# EAGLE design ArduStationMega0.4 (EAGLE 5.11)
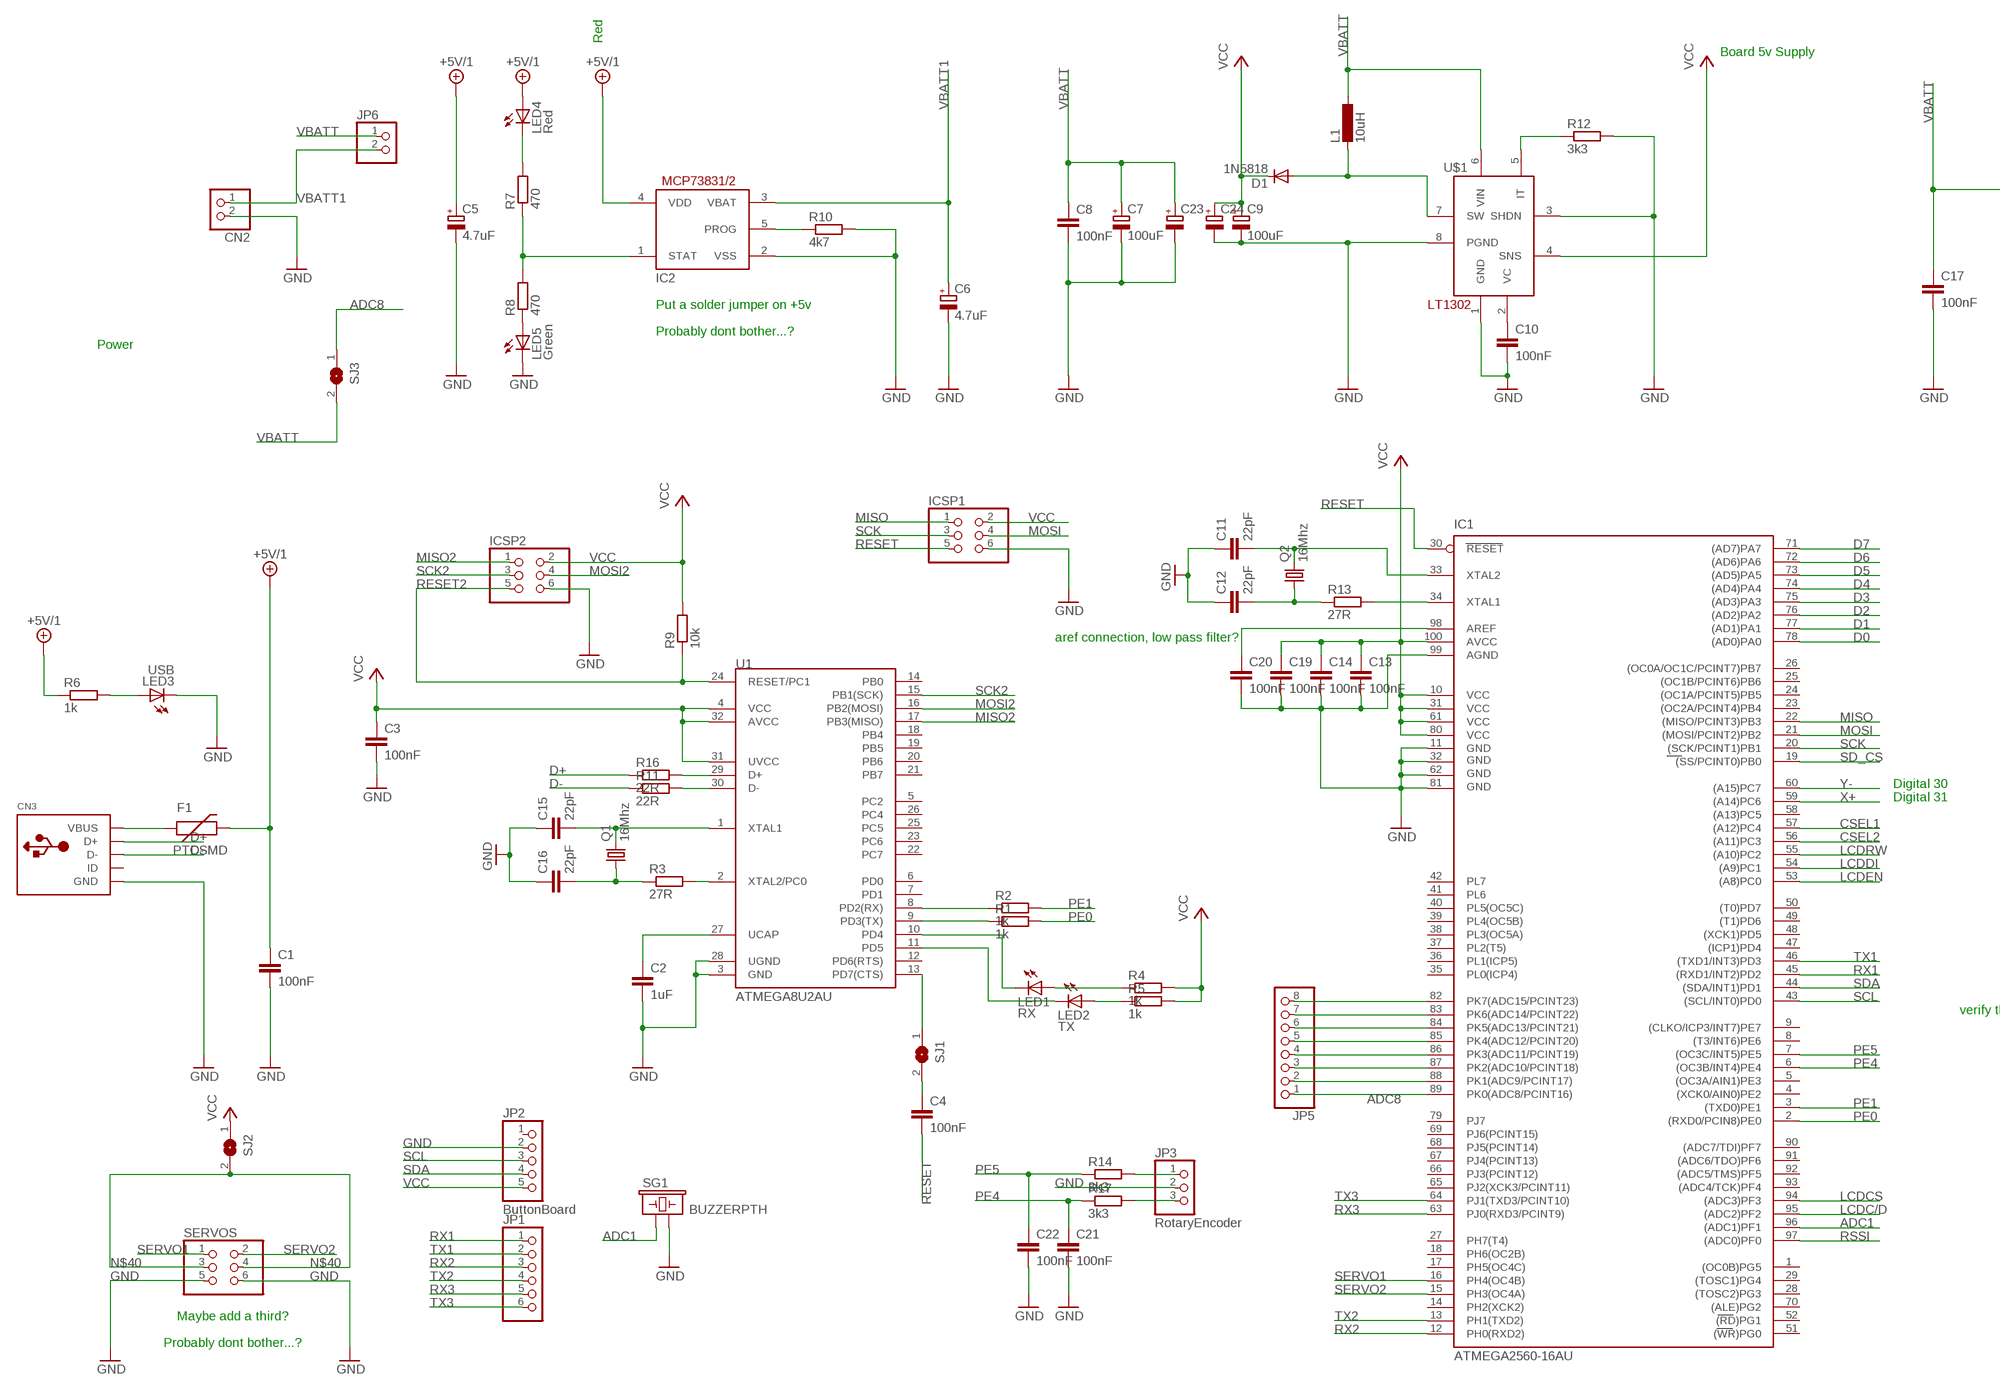
[diagram p0: schematic, sheet 1, part 1 of 2]
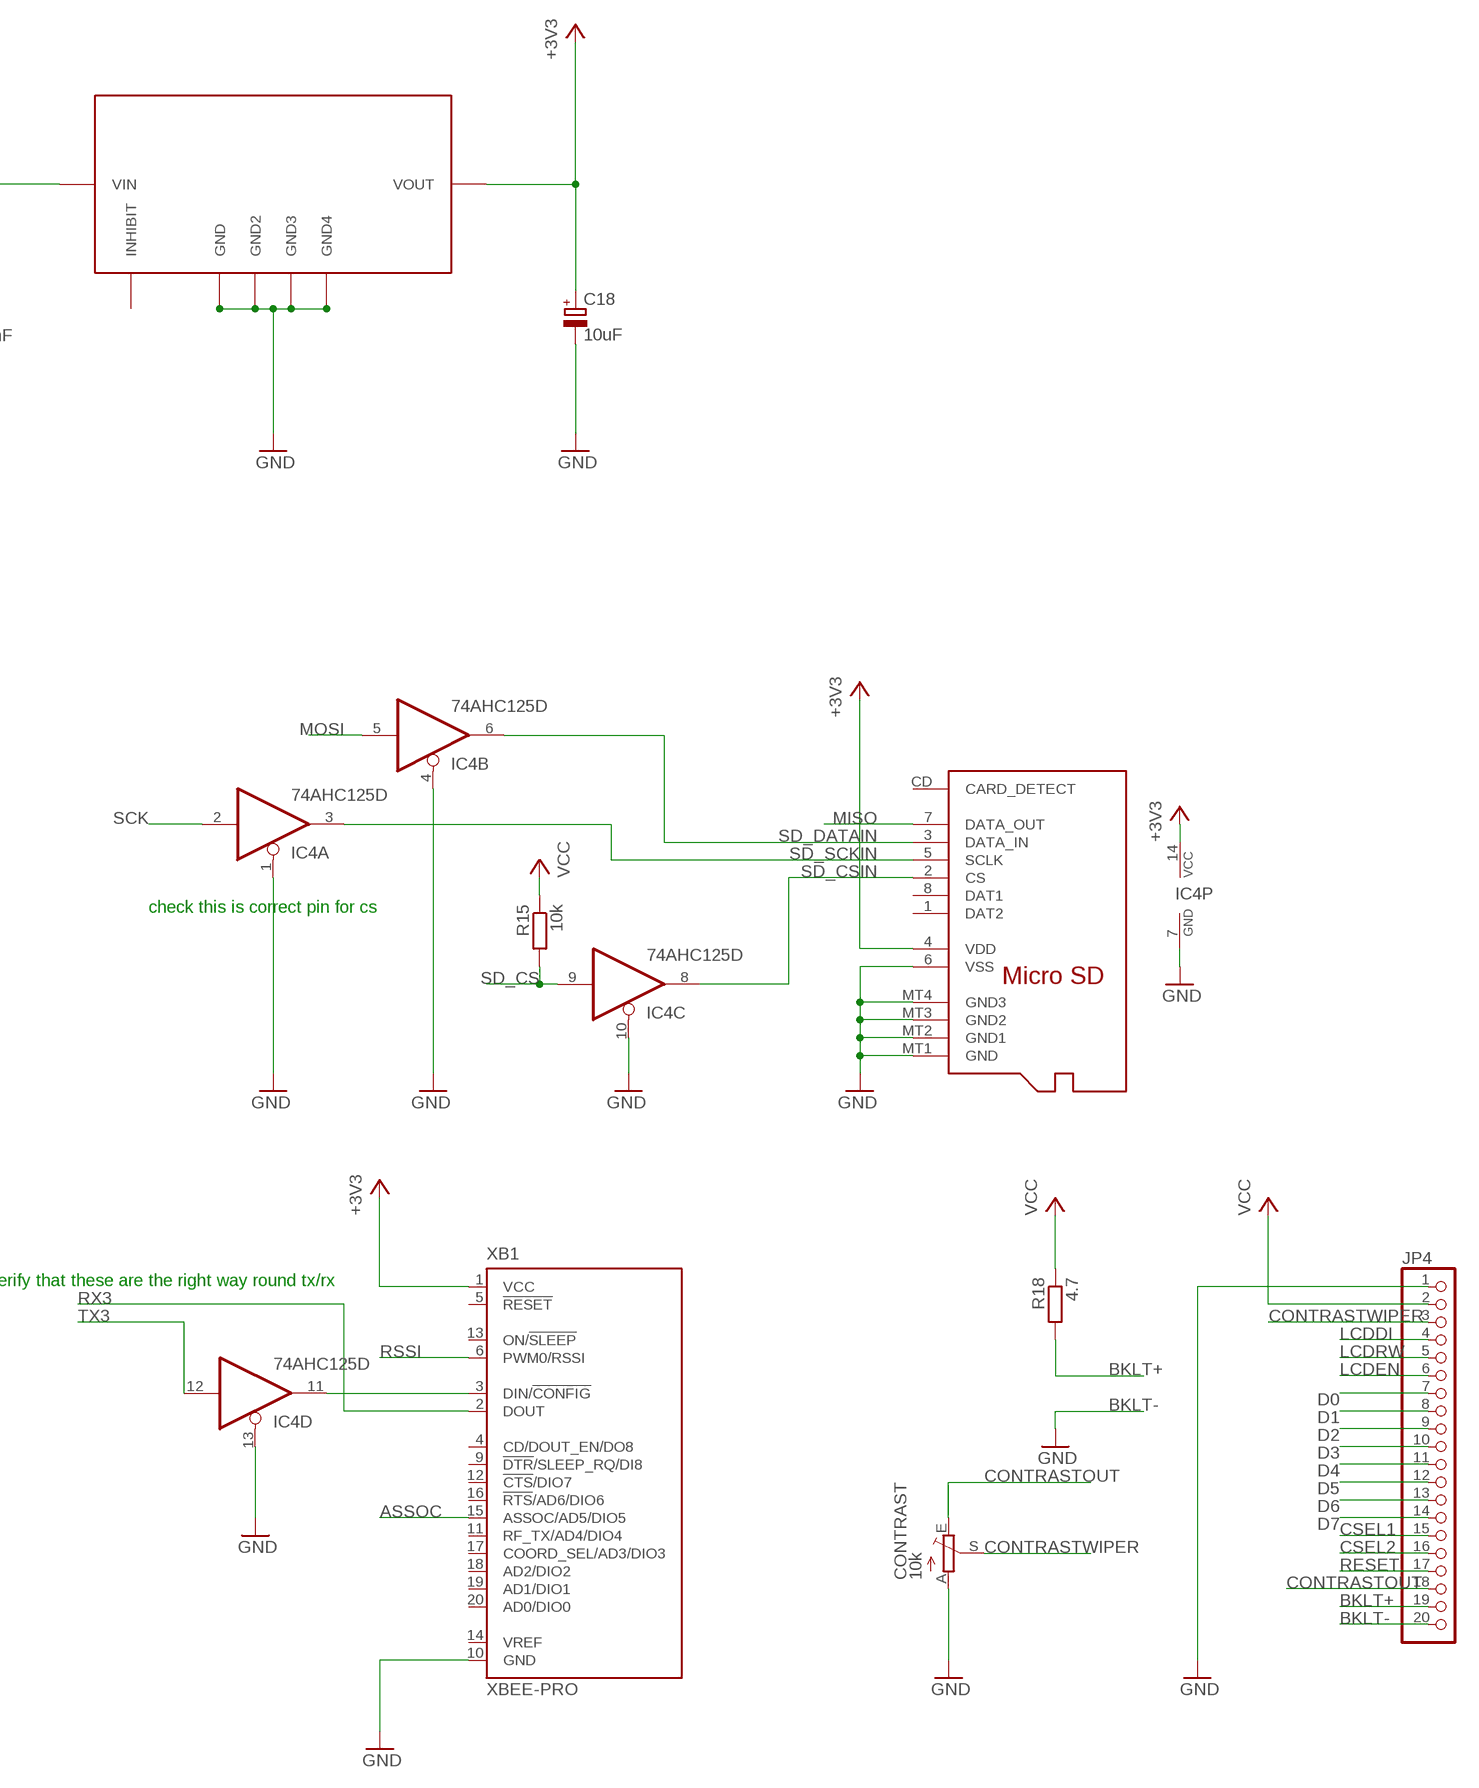
[diagram p1: schematic, sheet 1, part 2 of 2]

## Parts
C1  100nF  C-EUC0805  [C0805]
C2  1uF  C-EUC0805  [C0805]
C3  100nF  C-EUC0805  [C0805]
C4  100nF  C-EUC0805  [C0805]
C5  4.7uF  CPOL-EUA/3216-18R  [A/3216-18R]
C6  4.7uF  CPOL-EUA/3216-18R  [A/3216-18R]
C7  100uF  CPOL-EUD  [PANASONIC_D]
C8  100nF  C-EUC0805  [C0805]
C9  100uF  CPOL-EUD  [PANASONIC_D]
C10  100nF  C-EUC0805  [C0805]
C11  22pF  C-EUC0805  [C0805]
C12  22pF  C-EUC0805  [C0805]
C13  100nF  C-EUC0805  [C0805]
C14  100nF  C-EUC0805  [C0805]
C15  22pF  C-EUC0805  [C0805]
C16  22pF  C-EUC0805  [C0805]
C17  100nF  C-EUC0805  [C0805]
C18  10uF  CPOL-EUA/3216-18R  [A/3216-18R]
C19  100nF  C-EUC0805  [C0805]
C20  100nF  C-EUC0805  [C0805]
C21  100nF  C-EUC0805  [C0805]
C22  100nF  C-EUC0805  [C0805]
C23  CPOL-EUE2.5-7  [E2,5-7]
C24  CPOL-EUE2.5-7  [E2,5-7]
CN2  JST_2PIN-SMT-RA  [JST-PH-2-SMT-RA]
CN3  USB  [USB-MINIB-SMD-MOLEX]
CONTRAST  10k  TRIM_EU-B25P  [B25P]
D1  1N5818  DIODE-DO41-7.6  [DO41-7.6]
F1  PTCSMD  [PTC-1206]
IC1  ATMEGA2560-16AU  [TQFP100]
IC2  MCP73831/OT  [SOT23-5L]
IC4  74AHC125D  74ACT125D  [SO14]
ICSP1  PINHD-2X3  [2X03]
ICSP2  PINHD-2X3  [2X03]
JP1  PINHD-1X6  [1X06]
JP2  ButtonBoard  PINHD-1X5  [1X05]
JP3  RotaryEncoder  PINHD-1X3  [1X03]
JP4  PINHD-1X20  [1X20]
JP5  PINHD-1X8  [1X08]
JP6  PINHD-1X2/90  [1X02/90]
L1  10uH  L-EU6000-XXX-RC  [6000-XXXX-RC]
LED1  RX  LEDSMT1206  [1206]
LED2  TX  LEDSMT1206  [1206]
LED3  USB  LEDSMT1206  [1206]
LED4  Red  LEDSMT1206  [1206]
LED5  Green  LEDSMT1206  [1206]
Q1  16Mhz  CRYSTAL5X3  [CRYSTAL-SMD-5X3]
Q2  16Mhz  CRYSTAL5X3  [CRYSTAL-SMD-5X3]
R1  1k  R-EU_R0805  [R0805]
R2  1k  R-EU_R0805  [R0805]
R3  27R  R-EU_R0805  [R0805]
R4  1k  R-EU_R0805  [R0805]
R5  1k  R-EU_R0805  [R0805]
R6  1k  R-EU_R0805  [R0805]
R7  470  R-EU_R0805  [R0805]
R8  470  R-EU_R0805  [R0805]
R9  10k  R-EU_R0805  [R0805]
R10  4k7  R-EU_R0805  [R0805]
R11  22R  R-EU_R0805  [R0805]
R12  3k3  R-EU_R0805  [R0805]
R13  27R  R-EU_R0805  [R0805]
R14  3k3  R-EU_R0805  [R0805]
R15  10k  R-EU_R0805  [R0805]
R16  22R  R-EU_R0805  [R0805]
R17  3k3  R-EU_R0805  [R0805]
R18  4.7  R-EU_R0805  [R0805]
SERVOS  PINHD-2X3/90  [2X03/90]
SG1  BUZZERPTH  [BUZZER-12MM]
SJ1  SJ  [SJ]
SJ2  SJ  [SJ]
SJ3  SJ  [SJ]
U1  ATMEGA8U2AU  [TQFP32-08]
U$1  LT1302  [DIL08]
U$2  KF33BD-TR  [SO-8]
U$4  MICROSD  [MICROSD]
XB1  XBEE-PRO  [XBEE-PRO]

## Nets
+3V3: C18.+ IC4.14(P:VCC) U$2.1(VOUT) U$4.4(VDD) XB1.1(VCC)
+5V/1: C1.1 C5.+ F1.2 IC2.4(VDD) LED4.A R6.1
ADC1: IC1.96((ADC1)PF1) SG1.+
ADC8: IC1.89(PK0(ADC8/PCINT16)) JP5.1 SJ3.1
ADC15: IC1.82(PK7(ADC15/PCINT23)) JP5.8
ASSOC: XB1.15(ASSOC/AD5/DIO5)
BKLT+: JP4.19 R18.2
BKLT-: JP4.20 ; supply symbol labelled GND
CONTRASTOUT: CONTRAST.E JP4.18
CONTRASTWIPER: CONTRAST.S JP4.3
CSEL1: IC1.57((A12)PC4) JP4.15
CSEL2: IC1.56((A11)PC3) JP4.16
D0: IC1.78((AD0)PA0) JP4.7
D1: IC1.77((AD1)PA1) JP4.8
D2: IC1.76((AD2)PA2) JP4.9
D3: IC1.75((AD3)PA3) JP4.10
D4: IC1.74((AD4)PA4) JP4.11
D5: IC1.73((AD5)PA5) JP4.12
D6: IC1.72((AD6)PA6) JP4.13
D7: IC1.71((AD7)PA7) JP4.14
D+: CN3.D+ R16.1
D-: CN3.D- R11.1
GND: C1.2 C2.2 C3.2 C5.- C6.- C7.- C8.2 C9.- C10.2 C11.1 C12.1 C13.2 C14.2 C15.1 C16.1 C17.2 C18.- C19.2 C20.2 C21.2 C22.2 C23.- C24.- CN2.2 CN3.GND CONTRAST.A IC1.11(GND) IC1.32(GND1) IC1.62(GND2) IC1.81(GND3) IC1.99(AGND) IC2.2(VSS) IC4.1(A:OE) IC4.4(B:OE) IC4.7(P:GND) IC4.10(C:OE) IC4.13(D:OE) ICSP1.6 ICSP2.6 JP2.2 JP3.2 JP4.1 LED3.C LED5.C R10.2 R12.2 SERVOS.5 SERVOS.6 SG1.- U1.3(GND) U1.28(UGND) U$1.1(GND) U$1.3(SHDN) U$1.8(PGND) U$2.2(GND) U$2.3(GND2) U$2.6(GND3) U$2.7(GND4) U$4.6(VSS) U$4.MT1(GND) U$4.MT2(GND1) U$4.MT3(GND2) U$4.MT4(GND3) XB1.10(GND)
LCDC/D: IC1.95((ADC2)PF2)
LCDCS: IC1.94((ADC3)PF3)
LCDDI: IC1.54((A9)PC1) JP4.4
LCDEN: IC1.53((A8)PC0) JP4.6
LCDRW: IC1.55((A10)PC2) JP4.5
MISO: IC1.22((MISO/PCINT3)PB3) ICSP1.1 U$4.7(DATA_OUT)
MISO2: ICSP2.1 U1.17(PB3(MISO))
MOSI: IC1.21((MOSI/PCINT2)PB2) IC4.5(B:I) ICSP1.4
MOSI2: ICSP2.4 U1.16(PB2(MOSI))
N$1: IC4.11(D:O) XB1.3(DIN/!CONFIG)
N$2: LED3.A R6.2
N$3: C2.1 U1.27(UCAP)
N$4: R3.2 U1.2(XTAL2/PC0)
N$5: C16.2 Q1.1 R3.1
N$6: C15.2 Q1.3 U1.1(XTAL1)
N$7: LED1.C U1.10(PD4)
N$8: R2.1 U1.8(PD2(RX))
N$9: C4.1 SJ1.2
N$10: R1.1 U1.9(PD3(TX))
N$11: LED2.C U1.11(PD5)
N$12: LED1.A R4.1
N$13: LED2.A R5.1
N$14: R12.1 U$1.5(IT)
N$15: LED4.C R7.2
N$16: IC2.1(STAT) R7.1 R8.2
N$17: SJ1.1 U1.13(PD7(CTS))
N$18: R16.2 U1.29(D+)
N$19: R11.2 U1.30(D-)
N$20: JP3.3 R17.2
N$21: IC2.5(PROG) R10.1
N$22: JP3.1 R14.2
N$23: C10.1 U$1.2(VC)
N$24: CN3.VBUS F1.1
N$25: D1.A L1.2 U$1.7(SW)
N$26: LED5.A R8.1
N$27: IC1.34(XTAL1) R13.2
N$28: C12.2 Q2.1 R13.1
N$29: C11.2 IC1.33(XTAL2) Q2.3
N$31: C20.1 IC1.98(AREF)
N$32: IC1.88(PK1(ADC9/PCINT17)) JP5.2
N$33: IC1.87(PK2(ADC10/PCINT18)) JP5.3
N$34: IC1.86(PK3(ADC11/PCINT19)) JP5.4
N$35: IC1.85(PK4(ADC12/PCINT20)) JP5.5
N$36: IC1.84(PK5(ADC13/PCINT21)) JP5.6
N$37: IC1.83(PK6(ADC14/PCINT22)) JP5.7
N$40: SERVOS.3 SERVOS.4 SJ2.2
PE0: IC1.2((RXD0/PCIN8)PE0) R1.2
PE1: IC1.3((TXD0)PE1) R2.2
PE4: C21.1 IC1.6((OC3B/INT4)PE4) R17.1
PE5: C22.1 IC1.7((OC3C/INT5)PE5) R14.1
RESET: C4.2 IC1.30(RESET) ICSP1.5 JP4.17
RESET2: ICSP2.5 R9.1 U1.24(RESET/PC1)
RSSI: IC1.97((ADC0)PF0) XB1.6(PWM0/RSSI)
RX1: IC1.45((RXD1/INT2)PD2) JP1.1
RX2: IC1.12(PH0(RXD2)) JP1.3
RX3: IC1.63(PJ0(RXD3/PCINT9)) JP1.5 XB1.2(DOUT)
SCK: IC1.20((SCK/PCINT1)PB1) IC4.2(A:I) ICSP1.3
SCK2: ICSP2.3 U1.15(PB1(SCK))
SCL: IC1.43((SCL/INT0)PD0) JP2.3
SD_CS: IC1.19((SS/PCINT0)PB0) IC4.9(C:I) R15.2
SD_CSIN: IC4.8(C:O) U$4.2(CS)
SD_DATAIN: IC4.6(B:O) U$4.3(DATA_IN)
SD_SCKIN: IC4.3(A:O) U$4.5(SCLK)
SDA: IC1.44((SDA/INT1)PD1) JP2.4
SERVO1: IC1.16(PH4(OC4B)) SERVOS.1
SERVO2: IC1.15(PH3(OC4A)) SERVOS.2
TX1: IC1.46((TXD1/INT3)PD3) JP1.2
TX2: IC1.13(PH1(TXD2)) JP1.4
TX3: IC1.64(PJ1(TXD3/PCINT10)) IC4.12(D:I) JP1.6
VBATT: C7.+ C8.1 C17.1 C23.+ JP6.1 L1.1 SJ3.2 U$1.6(VIN) U$2.8(VIN)
VBATT1: C6.+ CN2.1 IC2.3(VBAT) JP6.2
VCC: C3.1 C9.+ C13.1 C14.1 C19.1 C24.+ D1.C IC1.10(VCC) IC1.31(VCC1) IC1.61(VCC2) IC1.80(VCC3) IC1.100(AVCC) ICSP1.2 ICSP2.2 JP2.5 JP4.2 R4.2 R5.2 R9.2 R15.1 R18.1 SJ2.1 U1.4(VCC) U1.31(UVCC) U1.32(AVCC) U$1.4(SNS)
X+: IC1.59((A14)PC6)
Y-: IC1.60((A15)PC7)
Unconnected: CN3.ID IC1.1((OC0B)PG5) IC1.4((XCK0/AIN0)PE2) IC1.5((OC3A/AIN1)PE3) IC1.8((T3/INT6)PE6) IC1.9((CLKO/ICP3/INT7)PE7) IC1.14(PH2(XCK2)) IC1.17(PH5(OC4C)) IC1.18(PH6(OC2B)) IC1.23((OC2A/PCINT4)PB4) IC1.24((OC1A/PCINT5)PB5) IC1.25((OC1B/PCINT6)PB6) IC1.26((OC0A/OC1C/PCINT7)PB7) IC1.27(PH7(T4)) IC1.28((TOSC2)PG3) IC1.29((TOSC1)PG4) IC1.35(PL0(ICP4)) IC1.36(PL1(ICP5)) IC1.37(PL2(T5)) IC1.38(PL3(OC5A)) IC1.39(PL4(OC5B)) IC1.40(PL5(OC5C)) IC1.41(PL6) IC1.42(PL7) IC1.47((ICP1)PD4) IC1.48((XCK1)PD5) IC1.49((T1)PD6) IC1.50((T0)PD7) IC1.51((WR)PG0) IC1.52((RD)PG1) IC1.58((A13)PC5) IC1.65(PJ2(XCK3/PCINT11)) IC1.66(PJ3(PCINT12)) IC1.67(PJ4(PCINT13)) IC1.68(PJ5(PCINT14)) IC1.69(PJ6(PCINT15)) IC1.70((ALE)PG2) IC1.79(PJ7) IC1.90((ADC7/TDI)PF7) IC1.91((ADC6/TDO)PF6) IC1.92((ADC5/TMS)PF5) IC1.93((ADC4/TCK)PF4) JP2.1 U1.5(PC2) U1.6(PD0) U1.7(PD1) U1.12(PD6(RTS)) U1.14(PB0) U1.18(PB4) U1.19(PB5) U1.20(PB6) U1.21(PB7) U1.22(PC7) U1.23(PC6) U1.25(PC5) U1.26(PC4) U$2.5(INHIBIT) U$4.1(DAT2) U$4.8(DAT1) U$4.CD(CARD_DETECT) XB1.4(CD/DOUT_EN/DO8) XB1.5(!RESET) XB1.9(!DTR!/SLEEP_RQ/DI8) XB1.11(RF_TX/AD4/DIO4) XB1.12(!CTS!/DIO7) XB1.13(ON/!SLEEP) XB1.14(VREF) XB1.16(!RTS!/AD6/DIO6) XB1.17(COORD_SEL/AD3/DIO3) XB1.18(AD2/DIO2) XB1.19(AD1/DIO1) XB1.20(AD0/DIO0)

## Notes on the sheet
- Red
- Board 5v Supply
- Put a solder jumper on +5v
- Probably dont bother...?
- Power
- aref connection, low pass filter?
- check this is correct pin for cs
- Digital 30
- Digital 31
- verify that these are the right way round tx/rx
- Maybe add a third?
- Probably dont bother...?

## Library data of the parts
C1-C4 C8 C10-C17 C19-C22 = rcl:C-EU: CAPACITOR, European symbol
C5-C7 C9 C18 C23 C24 = rcl:CPOL-EU: POLARIZED CAPACITOR, European symbol
CN2 = adafruit:JST_2PIN: JST 2-Pin Connectors of various flavors SMT-RA (S2B-PH-SM4) 4UConnector #17311 SMT (B2B-PH-SM4) THM-RA (S2B-PH) THM (B2B-PH)
CN3 = colin:USB: USB Connectors USBMINIB - Surface Mount Female Mini-B USB Connector 4UConnector: 06564 By microbuilder.eu Thru-hole RA Female Mini-B USB Connector 4UConnector: 18732 By ladyada.net
CONTRAST = pot:TRIM_EU-: POTENTIOMETER
D1 = diode:DIODE-: DIODE
F1 = SparkFun:PTC: Resettable Fuse PTC Resettable Fuse. Spark Fun Electronics SKU : COM-08357
IC1 = atmel-2005:ATMEGA*: MICROCONTROLLER 64/128/256 Kbytes FLASH 4 Kbytes EEPROM 8 Kbytes SRAM 86 General Purpose I/O pins 12-channels16-bit PWM 4 x Serial USARTs 16-channels 10-bit A/D
IC2 = adafruit:MCP73831: MCP73831/2 Miniature Single-Cell, Fully Integrated Li-Ion, Li-Polymer Charge Management Controllers. Nice and small simple lipoly charge controller, with adjustable current and status output (LED) http://www.ladyada.net/library/pcb/eaglelibrary.html
IC4 = 74xx-eu:74*125: Quad bus BUFFER, 3-state
ICSP1 ICSP2 SERVOS = pinhead:PINHD-2X3: PIN HEADER
JP1 = pinhead:PINHD-1X6: PIN HEADER
JP2 = pinhead:PINHD-1X5: PIN HEADER
JP3 = pinhead:PINHD-1X3: PIN HEADER
JP4 = pinhead:PINHD-1X20: PIN HEADER
JP5 = pinhead:PINHD-1X8: PIN HEADER
JP6 = pinhead:PINHD-1X2: PIN HEADER
L1 = rcl:L-EU: INDUCTOR, European symbol
LED1-LED5 = led:LED: LED OSRAM: - CHIPLED LG R971, LG N971, LY N971, LG Q971, LY Q971, LO R971, LY R971 LH N974, LH R974 LS Q976, LO Q976, LY Q976 LO Q996 - Hyper CHIPLED LW Q18S LB Q993, LB Q99A, LB R99A - SideLED LS A670, LO A670, LY A670, LG A670, LP A670 LB A673, LV A673, LT A673, LW A673 LH A674 LY A675 LS A676, LA A676, LO A676, LY A676, LW A676 LS A679, LY A679, LG A679 - Hyper Micro SIDELED® LS Y876, LA Y876, LO Y876, LY Y876 LT Y87S - SmartLED LW L88C, LW L88S LB L89C, LB L89S, LG L890 LS L89K, LO L89K, LY L89K LS L896, LA L896, LO L896, LY L896 - TOPLED LS T670, LO T670, LY T670, LG T670, LP T670 LSG T670, LSP T670, LSY T670, LOP T670, LYG T670 LG T671, LOG T671, LSG T671 LB T673, LV T673, LT T673, LW T673 LH T674 LS T676, LA T676, LO T676, LY T676, LB T676, LH T676, LSB T676, LW T676 LB T67C, LV T67C, LT T67C, LS T67K, LO T67K, LY T67K, LW E67C LS E67B, LA E67B, LO E67B, LY E67B, LB E67C, LV E67C, LT E67C LW T67C LS T679, LY T679, LG T679 LS T770, LO T770, LY T770, LG T770, LP T770 LB T773, LV T773, LT T773, LW T773 LH T774 LS E675, LA E675, LY E675, LS T675 LS T776, LA T776, LO T776, LY T776, LB T776 LHGB T686 LT T68C, LB T68C - Hyper Mini TOPLED® LB M676 - Mini TOPLED Santana® LG M470 LS M47K, LO M47K, LY M47K Source: http://www.osram.convergy.de LUXEON: - LUMILED® LXK2-PW12-R00, LXK2-PW12-S00, LXK2-PW14-U00, LXK2-PW14-V00 LXK2-PM12-R00, LXK2-PM12-S00, LXK2-PM14-U00 LXK2-PE12-Q00, LXK2-PE12-R00, LXK2-PE12-S00, LXK2-PE14-T00, LXK2-PE14-U00 LXK2-PB12-K00, LXK2-PB12-L00, LXK2-PB12-M00, LXK2-PB14-N00, LXK2-PB14-P00, LXK2-PB14-Q00 LXK2-PR12-L00, LXK2-PR12-M00, LXK2-PR14-Q00, LXK2-PR14-R00 LXK2-PD12-Q00, LXK2-PD12-R00, LXK2-PD12-S00 LXK2-PH12-R00, LXK2-PH12-S00 LXK2-PL12-P00, LXK2-PL12-Q00, LXK2-PL12-R00 Source: www.luxeon.com KINGBRIGHT: KA-3528ASYC Source: www.kingbright.com
Q1 Q2 = SparkFun:CRYSTAL: Crystals Various standard crystals. Proven footprints. Spark Fun Electronics SKU : COM-00534
R1-R18 = rcl:R-EU_: RESISTOR, European symbol
SG1 = SparkFun:BUZZER: Buzzer 12mm Spark Fun Electronics SKU : Comp-Buzzer
SJ1-SJ3 = jumper:SJ: SMD solder JUMPER
U1 = SparkFun:ATMEGA8U2: Atmel 8-bit Microcontroller with 8/16/32K Bystes of ISP Flash and USB Controller. ATmega8U2, ATmega16U2, and ATmega32U2
U$1 = adafruit:LT1302
U$2 = colin:KF33BD-TR
U$4 = colin:MICROSD
XB1 = maxstream:XBEE: XBee (TM) /XBee-PRO(TM) OEM RF Modules Source: MaxStream, Inc. xbee_productmanual.pdf; MPN: XBP24-AWI-001; OC_FARNELL: 1337916; OC_NEWARK: 42M2667

## Net classes
1 power: width 0.61 mm

## Board
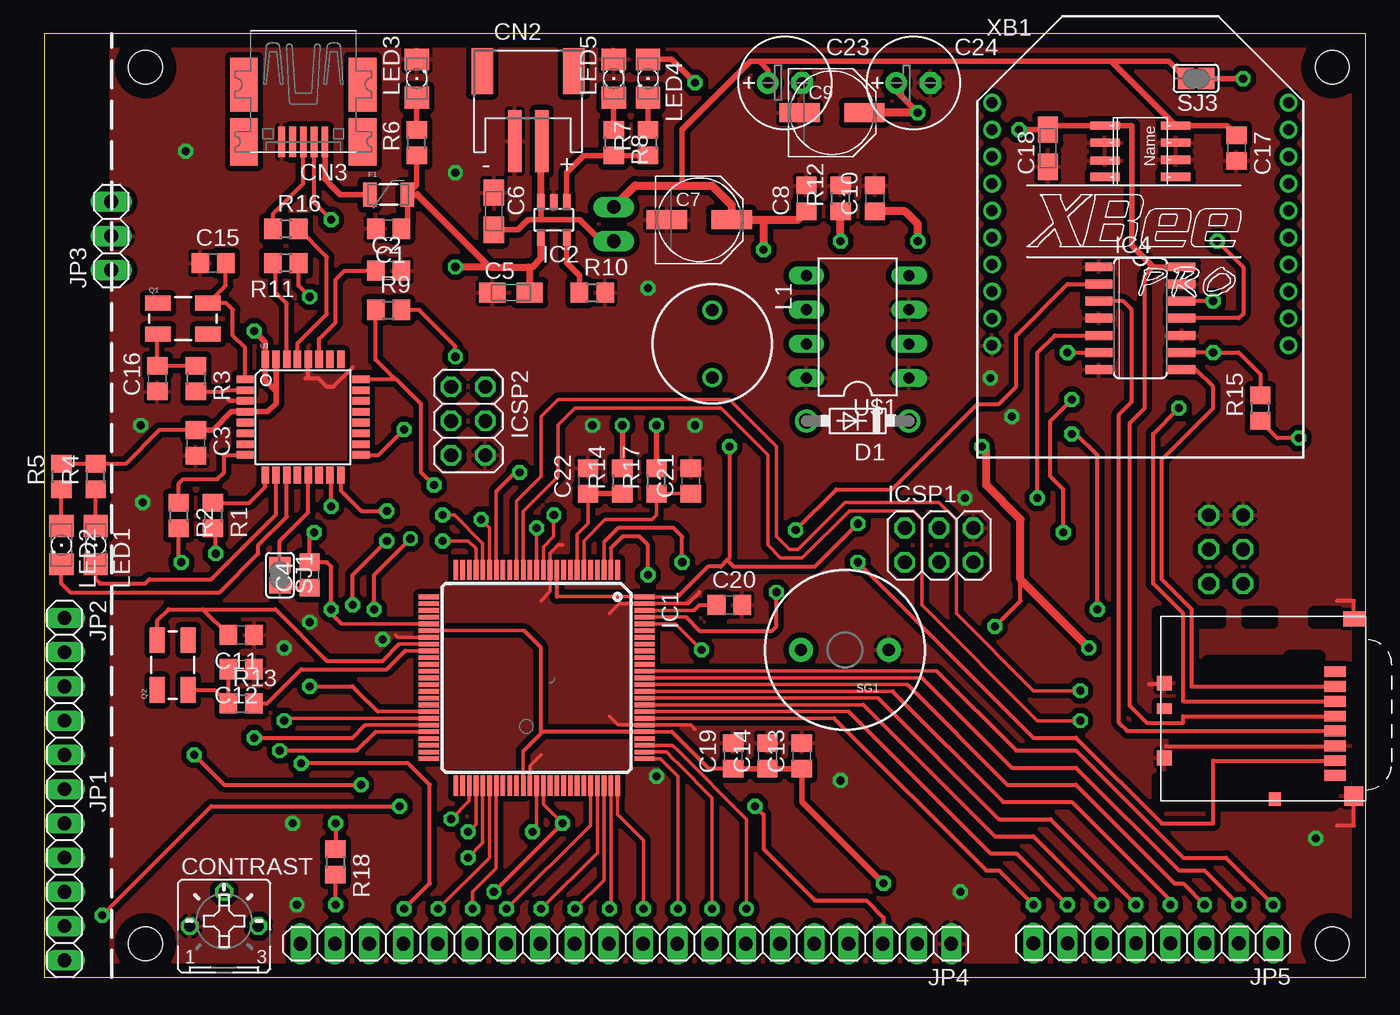
[diagram p2: board, top side]
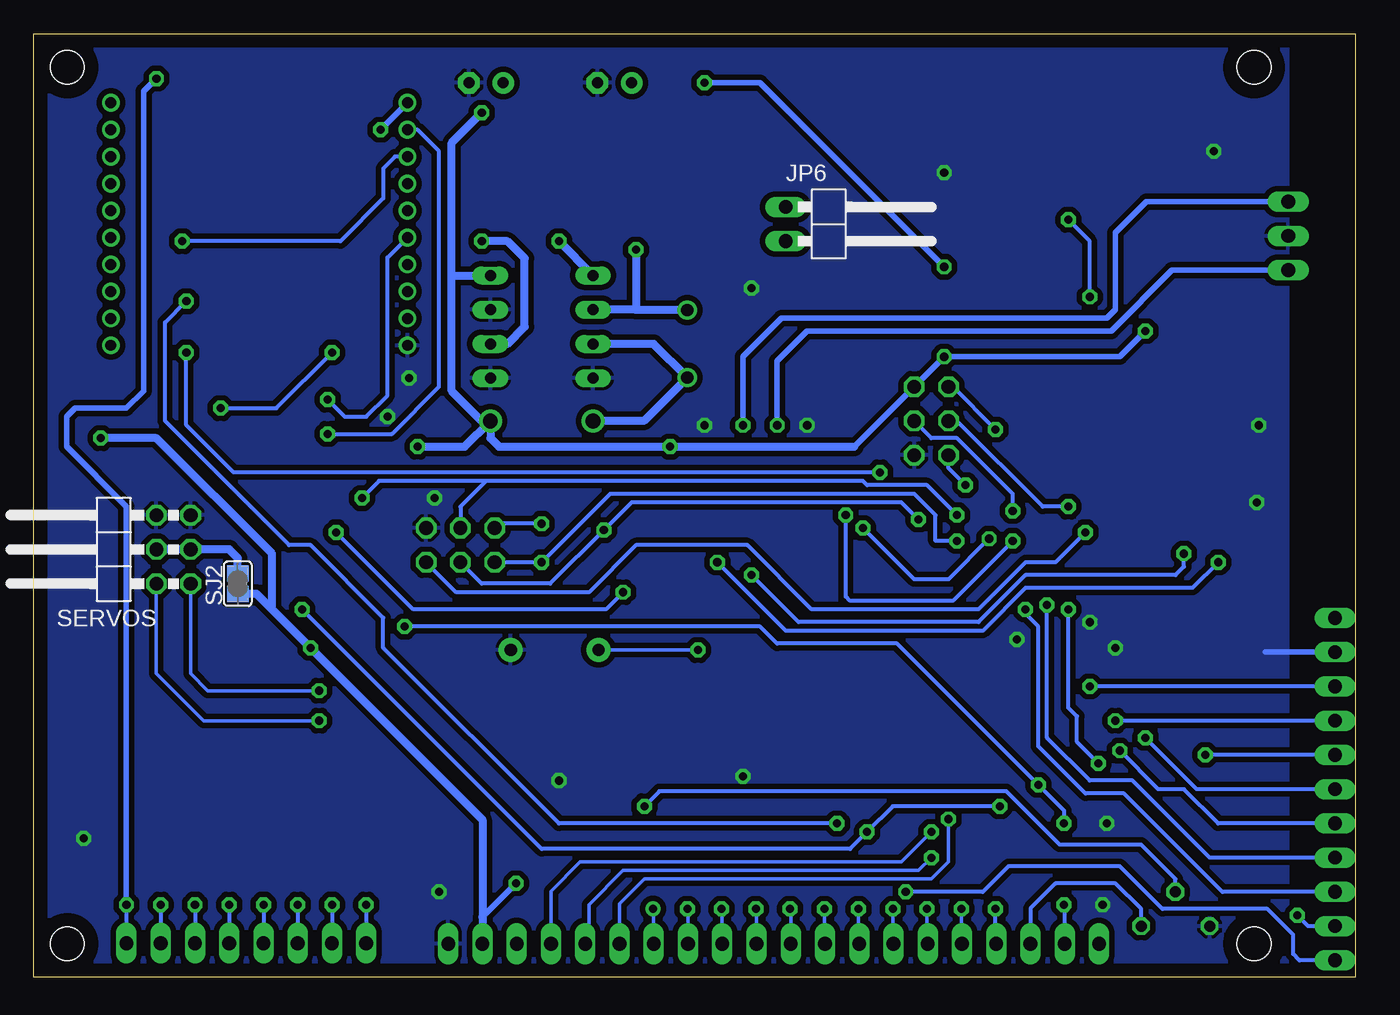
[diagram p3: board, bottom side, seen from below]

Size 98 x 70 mm. Coordinates in mm from the lower left corner, seen from the top.
Outline: 0,0 98,0 98,70 0,70 0,0
Copper layers (1*16): Top 0.035mm / dielectric 1.5mm / Bottom 0.035mm
Design rules "default *": minimum track width 10mil, minimum drill 0.6mm, track to track 8mil, track to pad 8mil, pad to pad 8mil, via to via 8mil, smd to smd 8mil, copper to edge 40mil, drill to drill 8mil, minimum pad ring 10mil, minimum via ring 10mil, stop-mask expansion 4mil, vias tented up to drill 0mil, thermal gap 10mil
Holes 2.5 mm at 7.5,2.5 7.5,67.5 95.5,67.5 95.5,2.5

### Footprints (pad centres in the part's own frame; a part is rotated, then mirrored left to right if it is on the bottom)
C0805 = smd 1.3 x 1.5: 1 -0.95,0; 2 0.95,0
A/3216-18R = smd 1.95 x 1.5: + 1.375,0; - -1.375,0
PANASONIC_D = smd 3 x 1.4: + 2.4,0; - -2.4,0
E2,5-7 = drill 0.813 pad 1.6 round: + -1.27,0 | drill 0.813 pad 1.6 octagon: - 1.27,0
JST-PH-2-SMT-RA = smd 1 x 4.6: 1 1,-3.7; 2 -1,-3.7 | smd 1.6 x 3.4: NC1 -3.4,1.5; NC2 3.4,1.5
USB-MINIB-SMD-MOLEX = smd 0.5 x 2.25: D+ 0,3.75; D- -0.8,3.75; GND 1.6,3.75; ID 0.8,3.75; VBUS -1.6,3.75 | smd 2.05 x 4: GND1 -4.4,-0.5; GND4 4.4,-0.5 | smd 2.05 x 3.5: GND2 -4.4,3.75; GND3 4.4,3.75
B25P = drill 0.813 octagon: A -2.54,0; E 2.54,0; S 0,2.54
DO41-7.6 = drill 1.1 pad 1.7 round: A 3.81,0; C -3.81,0
PTC-1206 = smd 1 x 1.8: 1 -1.4,0; 2 1.4,0
TQFP100 = smd 1.5 x 0.35: 1 -8,6; 2 -8,5.5; 3 -8,5; 4 -8,4.5; 5 -8,4; 6 -8,3.5; 7 -8,3; 8 -8,2.5; 9 -8,2; 10 -8,1.5; 11 -8,1; 12 -8,0.5; 13 -8,0; 14 -8,-0.5; 15 -8,-1; 16 -8,-1.5; 17 -8,-2; 18 -8,-2.5; 19 -8,-3; 20 -8,-3.5; 21 -8,-4; 22 -8,-4.5; 23 -8,-5; 24 -8,-5.5; 25 -8,-6; 51 8,-6; 52 8,-5.5; 53 8,-5; 54 8,-4.5; 55 8,-4; 56 8,-3.5; 57 8,-3; 58 8,-2.5; 59 8,-2; 60 8,-1.5; 61 8,-1; 62 8,-0.5; 63 8,0; 64 8,0.5; 65 8,1; 66 8,1.5; 67 8,2; 68 8,2.5; 69 8,3; 70 8,3.5; 71 8,4; 72 8,4.5; 73 8,5; 74 8,5.5; 75 8,6 | smd 0.35 x 1.5: 26 -6,-8; 27 -5.5,-8; 28 -5,-8; 29 -4.5,-8; 30 -4,-8; 31 -3.5,-8; 32 -3,-8; 33 -2.5,-8; 34 -2,-8; 35 -1.5,-8; 36 -1,-8; 37 -0.5,-8; 38 0,-8; 39 0.5,-8; 40 1,-8; 41 1.5,-8; 42 2,-8; 43 2.5,-8; 44 3,-8; 45 3.5,-8; 46 4,-8; 47 4.5,-8; 48 5,-8; 49 5.5,-8; 50 6,-8; 76 6,8; 77 5.5,8; 78 5,8; 79 4.5,8; 80 4,8; 81 3.5,8; 82 3,8; 83 2.5,8; 84 2,8; 85 1.5,8; 86 1,8; 87 0.5,8; 88 0,8; 89 -0.5,8; 90 -1,8; 91 -1.5,8; 92 -2,8; 93 -2.5,8; 94 -3,8; 95 -3.5,8; 96 -4,8; 97 -4.5,8; 98 -5,8; 99 -5.5,8; 100 -6,8
SOT23-5L = smd 0.55 x 1.2: 1 -0.95,-1.3; 2 0,-1.3; 3 0.95,-1.3; 4 0.95,1.3; 5 -0.95,1.3
SO14 = smd 0.66 x 2.032: 1 -3.81,-3.073; 2 -2.54,-3.073; 3 -1.27,-3.073; 4 0,-3.073; 5 1.27,-3.073; 6 2.54,-3.073; 7 3.81,-3.073; 8 3.81,3.073; 9 2.54,3.073; 10 1.27,3.073; 11 0,3.073; 12 -1.27,3.073; 13 -2.54,3.073; 14 -3.81,3.073
2X03 = drill 1.016 octagon: 1 -2.54,-1.27; 2 -2.54,1.27; 3 0,-1.27; 4 0,1.27; 5 2.54,-1.27; 6 2.54,1.27
1X06 = drill 1.016 long: 1 -6.35,0; 2 -3.81,0; 3 -1.27,0; 4 1.27,0; 5 3.81,0; 6 6.35,0
1X05 = drill 1.016 long: 1 -5.08,0; 2 -2.54,0; 3 0,0; 4 2.54,0; 5 5.08,0
1X03 = drill 1.016 long: 1 -2.54,0; 2 0,0; 3 2.54,0
1X20 = drill 1.016 long: 1 -24.13,0; 2 -21.59,0; 3 -19.05,0; 4 -16.51,0; 5 -13.97,0; 6 -11.43,0; 7 -8.89,0; 8 -6.35,0; 9 -3.81,0; 10 -1.27,0; 11 1.27,0; 12 3.81,0; 13 6.35,0; 14 8.89,0; 15 11.43,0; 16 13.97,0; 17 16.51,0; 18 19.05,0; 19 21.59,0; 20 24.13,0
1X08 = drill 1.016 long: 1 -8.89,0; 2 -6.35,0; 3 -3.81,0; 4 -1.27,0; 5 1.27,0; 6 3.81,0; 7 6.35,0; 8 8.89,0
1X02/90 = drill 1.016 long: 1 -1.27,-3.81; 2 1.27,-3.81
6000-XXXX-RC = drill 0.9 pad 1.422 round: 1 -2.5,0; 2 2.5,0
1206 = smd 1.6 x 1.803: A -1.422,0; C 1.422,0
CRYSTAL-SMD-5X3 = smd 1.9 x 1.1: 1 -1.85,-1.15; 2 1.85,-1.15; 3 1.85,1.15; 4 -1.85,1.15
R0805 = smd 1.3 x 1.5: 1 -0.95,0; 2 0.95,0
2X03/90 = drill 1.016 octagon: 1 -2.54,-6.35; 2 -2.54,-3.81; 3 0,-6.35; 4 0,-3.81; 5 2.54,-6.35; 6 2.54,-3.81
BUZZER-12MM = drill 0.9 pad 1.778 round: + 3.25,0; - -3.25,0
SJ = smd 1.168 x 1.6: 1 -0.762,0; 2 0.762,0
TQFP32-08 = smd 1.27 x 0.559: 1 -4.293,2.8; 2 -4.293,2; 3 -4.293,1.2; 4 -4.293,0.4; 5 -4.293,-0.4; 6 -4.293,-1.2; 7 -4.293,-2; 8 -4.293,-2.8; 17 4.293,-2.8; 18 4.293,-2; 19 4.293,-1.2; 20 4.293,-0.4; 21 4.293,0.4; 22 4.293,1.2; 23 4.293,2; 24 4.293,2.8 | smd 0.559 x 1.27: 9 -2.8,-4.293; 10 -2,-4.293; 11 -1.2,-4.293; 12 -0.4,-4.293; 13 0.4,-4.293; 14 1.2,-4.293; 15 2,-4.293; 16 2.8,-4.293; 25 2.8,4.293; 26 2,4.293; 27 1.2,4.293; 28 0.4,4.293; 29 -0.4,4.293; 30 -1.2,4.293; 31 -2,4.293; 32 -2.8,4.293
DIL08 = drill 0.813 long: 1 -3.81,-3.81; 2 -1.27,-3.81; 3 1.27,-3.81; 4 3.81,-3.81; 5 3.81,3.81; 6 1.27,3.81; 7 -1.27,3.81; 8 -3.81,3.81
SO-8 = smd 0.61 x 2.21: 1 -1.905,-2.616; 2 -0.635,-2.616; 3 0.686,-2.616; 4 1.905,-2.616; 5 1.905,2.616; 6 0.635,2.616; 7 -0.635,2.616; 8 -1.905,2.616
MICROSD = smd 0.8 x 1.6: 1 3.2,1.7; 2 2.1,1.7; 3 1,1.7; 4 -0.1,1.7; 5 -1.2,1.7; 6 -2.3,1.7; 7 -3.4,1.7; 8 -4.5,1.7 | smd 0.8 x 1.1: CD 0.45,14.35 | smd 1.45 x 1.4: MT1 -6.025,0.3 | smd 1.1 x 1.6: MT2 7.1,0.3 | smd 1.1 x 1.1: MT3 2.35,14.35; MT4 -3.2,14.35 | smd 1 x 0.9: P$9 -6.25,6.15
XBEE-PRO = drill 0.8 pad 1.27 round: 1 -11,9; 2 -11,7; 3 -11,5; 4 -11,3; 5 -11,1; 6 -11,-1; 7 -11,-3; 8 -11,-5; 9 -11,-7; 10 -11,-9; 11 11,-9; 12 11,-7; 13 11,-5; 14 11,-3; 15 11,-1; 16 11,1; 17 11,3; 18 11,5; 19 11,7; 20 11,9

### Placement (x,y rotation side)
C1  25.53,55.53 180 top
C2  25.53,52.42 0 top
C3  11.24,39.66 270 top
C4  19.68,29.84 90 top
C5  34.61,50.8 0 top
C6  33.34,56.83 270 top
C7  48.58,56.2 0 top
C8  56.52,57.78 90 top
C9  58.42,64.14 0 top
C10  61.59,57.78 90 top
C11  14.61,25.4 180 top
C12  14.61,22.86 180 top
C13  56.17,16.44 90 top
C14  53.63,16.44 90 top
C15  12.51,52.99 0 top
C16  8.38,44.42 90 top
C17  88.41,61.52 270 top
C18  74.43,61.51 90 top
C19  51.09,16.44 90 top
C20  50.8,27.62 0 top
C21  47.94,36.83 90 top
C22  40.32,36.83 90 top
C23  54.93,66.36 0 top
C24  64.45,66.36 0 top
CN2  35.88,65.72 0 top
CN3  19.21,65.72 180 top
CONTRAST  13.34,3.81 0 top
D1  60.33,41.27 180 top
F1  25.53,58.07 0 top
IC1  36.51,22.23 270 top
IC2  37.78,56.2 180 top
IC4  81.28,48.9 270 top
ICSP1  66.36,32.07 0 top
ICSP2  31.43,41.27 270 top
JP1  1.5,7.62 270 top
JP2  1.5,21.59 270 top
JP3  4.96,55 90 top
JP4  43.13,2.5 180 top
JP5  82.23,2.54 180 top
JP6  38.42,55.88 270 bottom
L1  49.53,46.99 270 top
LED1  3.81,32.07 270 top
LED2  1.27,32.07 270 top
LED3  27.62,66.67 90 top
LED4  44.77,66.67 270 top
LED5  42.23,66.67 90 top
Q1  10.29,48.86 0 top
Q2  9.53,23.18 90 top
R1  12.51,34.26 270 top
R2  9.97,34.26 270 top
R3  11.24,44.42 270 top
R4  3.81,37.15 90 top
R5  1.27,37.15 90 top
R6  27.62,61.91 90 top
R7  44.77,61.91 90 top
R8  42.23,61.91 270 top
R9  25.53,49.51 0 top
R10  40.64,50.8 0 top
R11  17.91,52.99 180 top
R12  59.05,57.78 90 top
R13  14.61,20.32 0 top
R14  42.86,36.83 90 top
R15  90.17,42.23 90 top
R16  17.91,55.53 0 top
R17  45.4,36.83 90 top
R18  21.59,8.57 270 top
SERVOS  92.71,31.75 90 bottom
SG1  59.37,24.29 180 top
SJ1  17.46,29.84 270 top
SJ2  82.87,29.21 90 bottom
SJ3  85.41,66.67 180 top
U1  19.18,41.56 0 top
U$1  60.33,48.26 90 top
U$2  81.28,61.28 270 top
U$4  97.41,19.48 90 top
XB1  81.28,55.88 0 top

### Tracks (layer width: path | path; a pad name or v marks a point on that pad's centre or on a via)
+3V3  (via drill 0.6)
  Top 0.305: U$4.4 84.45,19.38 84.45,18.89 81.76,18.89 80.49,20.16 80.49,41.12 81.6,42.23 81.6,52.07 82.23,52.7
  Top 0.406: v72.28,62.88 C18.+ 74.73,63.18 U$2.1 80.64,63.18 80.64,54.29 82.23,52.7 IC4.14
  Bottom 0.406: v72.28,62.88 XB1.1
+5V/1  (via drill 0.6)
  Top 0.406: LED4.A 46.52,68.1 v48.26,66.36 | R6.1 27.62,58.77 F1.2 26.93,55.98 C1.1
  Top 0.508: 33.02,52.7 v30.48,52.7 | 33.02,52.7 35.88,52.7 | 35.88,52.7 36.2,52.7 36.83,53.34 IC2.4 | F1.2 27.66,58.07 33.02,52.7 | C5.+ 35.98,52.6 35.88,52.7
  Bottom 0.406: v48.26,66.36 44.13,66.36 v30.48,52.7
ADC1  (via drill 0.6)
  Top 0.254: IC1.96 46.8,26.23 v48.74,24.29
  Bottom 0.254: v48.74,24.29 SG1.+
ADC8  (via drill 0.6)
  Top 0.254: IC1.89 66.17,22.73
  Top 0.305: 66.17,22.73 72.07,16.83 76.52,16.83 84.45,8.89 87.63,8.89 v91.12,5.4
  Top 0.406: v88.9,66.67 SJ3.1
  Bottom 0.305: v91.12,5.4 JP5.1
  Bottom 0.406: v88.9,66.67 89.85,65.72 89.85,43.5 91.12,42.23 94.93,42.23 95.57,41.59 95.57,39.37 91.12,34.92 v91.12,5.4
ADC15  (via drill 0.6)
  Top 0.254: IC1.82 58.56,19.23
  Top 0.305: v73.34,5.4 70.8,7.94 69.85,7.94 58.56,19.23
  Bottom 0.305: v73.34,5.4 JP5.8
BKLT+  (via drill 0.6)
  Top 0.305: v21.59,5.4 R18.2
  Bottom 0.305: JP4.19 21.54,5.35 v21.59,5.4
CONTRASTOUT
  Bottom 0.305: CONTRAST.E 15.88,5.08 17.78,6.99 22.23,6.99 24.08,5.13 JP4.18
CONTRASTWIPER  (via drill 0.6)
  Top 0.305: v52.7,12.7 53.34,12.06 53.34,9.53 57.15,5.71 60.96,5.71 62.23,4.45 62.23,2.55 JP4.3
  Bottom 0.305: CONTRAST.S 13.34,7.3 15.88,9.84 21.91,9.84 25.88,13.81 51.59,13.81 v52.7,12.7
CSEL1  (via drill 0.6 pad 0.25)
  Top 0.254: v31.75,5.08 31.75,6.35 33.51,8.11 IC1.57
  Bottom 0.254: JP4.15 31.75,2.55 v31.75,5.08
CSEL2  (via drill 0.6 pad 0.25)
  Top 0.254: v29.21,5.08 33.01,8.88 IC1.56
  Bottom 0.254: JP4.16 29.21,2.55 v29.21,5.08
D0  (via drill 0.6)
  Top 0.254: v52.07,5.08 52.07,11.75 46.99,16.83 46.67,17.14 46.59,17.23 IC1.78
  Bottom 0.254: JP4.7 52.02,5.03 v52.07,5.08
D1  (via drill 0.6 pad 0.25)
  Top 0.254: v49.53,5.08 49.53,13.34 46.99,15.88 46.67,16.19 46.14,16.73 IC1.77
  Bottom 0.254: JP4.8 49.48,5.03 v49.53,5.08
D2  (via drill 0.6 pad 0.25)
  Top 0.254: v46.99,5.08 46.99,14.92 45.69,16.23 IC1.76
  Bottom 0.254: JP4.9 46.94,5.03 v46.99,5.08
D3  (via drill 0.6 pad 0.25)
  Top 0.254: v44.45,5.08 44.45,10.16 42.51,12.1 IC1.75
  Bottom 0.254: JP4.10 44.4,5.03 v44.45,5.08
D4  (via drill 0.6 pad 0.25)
  Top 0.254: v41.91,5.08 42.01,5.18 IC1.74
  Bottom 0.254: JP4.11 41.86,5.03 v41.91,5.08
D5  (via drill 0.6 pad 0.25)
  Top 0.254: v39.37,5.08 41.51,7.22 IC1.73
  Bottom 0.254: JP4.12 39.37,2.55 v39.37,5.08
D6  (via drill 0.6 pad 0.25)
  Top 0.254: v36.83,5.08 41.01,9.26 IC1.72
  Bottom 0.254: JP4.13 36.83,2.55 v36.83,5.08
D7  (via drill 0.6 pad 0.25)
  Top 0.254: v34.29,5.08 40.51,11.3 IC1.71
  Bottom 0.254: JP4.14 34.29,2.55 v34.29,5.08
D+
  Top 0.305: R16.1 16.96,56.65 18.34,58.02 19.18,58.87 19.21,58.9 CN3.D+
D-  (via drill 0.6 pad 0.25)
  Top 0.305: R11.1 18.86,51.31 v19.68,50.48 | v21.27,56.2 20.48,56.99 20.01,57.46 | 20.01,57.46 19.98,57.49 | 20.01,57.46 CN3.D-
  Bottom 0.305: v19.68,50.48 19.68,54.61 v21.27,56.2
GND  (via drill 0.6)
  Top 0.254: IC1.32 26.21,25.23 26.04,25.4 | 48.26,18.41 47.95,18.73 IC1.81 42.55,18.73 41.91,19.37 | IC1.62 36.01,15.69 36.83,16.51 | 38.42,32.07 38.1,32.07 37.51,31.48 IC1.11 37.51,28.62 36.83,27.94 | 47.73,27.73 IC1.99 42.65,27.73 41.91,26.99
  Top 0.305: U$4.MT2 97.11,27.94 95.89,27.94 | U$4.MT1 97.11,11.27 95.89,11.27 | U1.3 13.76,42.76 13.65,42.86 | U1.28 19.58,44.66 19.37,44.45 20.32,44.45 20.95,43.81 21.43,43.81 22.86,45.24 | 47.73,27.73 48.58,28.57 | U$4.MT3 82.98,21.75 81.92,21.75 | U$4.6 95.67,17.14 83.19,17.14
  Bottom 0.406: JP2.2 6.67,24.13
  other vias: 30.48,59.69 44.77,51.12 17.78,24.45 45.4,14.92 18.73,5.4 7.3,35.24 18.41,11.43 25.08,25.08 19.68,26.35 10.48,61.28 7.14,40.96 67.94,6.35 59.05,14.61 70.17,44.45 94.3,10.32 68.26,35.56 71.75,41.59 48.26,40.96 40.64,40.96
  pour Top (isolate 0.406): 5,0 5,70 98,70 98,0
  pour Bottom (isolate 0.406): 5,0 5,70 98,70 98,0
LCDDI  (via drill 0.6 pad 0.25)
  Top 0.254: v31.43,10.79 32.01,11.38 IC1.54
  Bottom 0.254: JP4.4 59.64,6.4 57.47,8.57 33.66,8.57 v31.43,10.79
LCDEN  (via drill 0.6 pad 0.25)
  Top 0.254: IC1.53 31.51,13.1 v30.16,11.75
  Bottom 0.254: JP4.6 54.56,5.45 52.7,7.3 31.43,7.3 30.16,8.57 v30.16,11.75
LCDRW  (via drill 0.6 pad 0.25)
  Top 0.254: v31.43,8.89 32.51,9.97 IC1.55
  Bottom 0.254: JP4.5 56.83,2.77 56.83,5.4 54.29,7.94 32.38,7.94 v31.43,8.89
MISO  (via drill 0.6 pad 0.25)
  Top 0.254: v29.53,32.38 31.43,32.38 32.01,31.8 IC1.22
  Top 0.305: v60.33,30.8 73.34,17.78 76.52,17.78 82.87,11.43 86.68,11.43 86.68,16.08 U$4.7
  Bottom 0.305: v29.53,32.38 31.11,32.38 31.11,34.29 32.7,35.88 55.24,35.88 v60.33,30.8 ICSP1.1
MISO2  (via drill 0.6)
  Top 0.305: v26.67,40.64 24.79,38.76 U1.17
  Bottom 0.305: ICSP2.1 29.84,43.81 v26.67,40.64
MOSI  (via drill 0.6 pad 0.25)
  Top 0.254: IC1.21 32.51,32.2 30.42,34.29 v29.53,34.29
  Top 0.305: IC4.5 74.93,47.62 73.66,46.35 v73.66,35.56
  Bottom 0.305: ICSP1.4 66.36,34.92 64.45,36.83 | v29.53,34.29 31.75,36.51 36.2,36.51 36.51,36.83 64.45,36.83 | v73.66,35.56 72.39,36.83 64.45,36.83
MOSI2  (via drill 0.6)
  Top 0.305: v25.4,34.61 23.5,34.61 21.98,36.12 U1.16
  Bottom 0.305: v25.4,34.61 25.4,35.88 29.53,40.01 31.43,40.01 ICSP2.4
N$1  (via drill 0.6 pad 0.25)
  Top 0.305: IC4.11 88.58,48.9 88.9,49.21 88.9,52.7 v87,54.61
  Bottom 0.305: v87,54.61 75.25,54.61 72.07,57.78 72.07,60.01 71.2,60.88 XB1.3
N$2
  Top 0.406: R6.2 LED3.A
N$3
  Top 0.305: C2.1 22.26,52.42 21.59,51.75 21.59,48.58 20.38,47.37 U1.27
N$4
  Top 0.305: U1.2 13.4,43.56 13.3,43.47 R3.2
N$5
  Top 0.305: R3.1 C16.2 8.38,47.66 Q1.1
N$6
  Top 0.305: C15.2 13.46,51.34 Q1.3 13.49,50.01 13.97,49.53 13.97,47.62 14.89,46.71 U1.1
N$7
  Top 0.305: LED1.C 3.81,29.53 4.13,29.21 7.47,29.21 7.79,29.53 12.38,29.53 17.18,34.33 U1.10
N$8
  Top 0.305: U1.8 14.86,38.73 13.34,38.73 13.34,37.47 12.83,36.96 10.29,36.96 9.97,36.64 R2.1
N$9
  Top 0.305: SJ1.2 17.65,28.89 C4.1
N$10
  Top 0.305: U1.9 16.38,36.38 15.21,35.21 R1.1
N$11
  Top 0.305: LED2.C 1.27,29.21 1.91,28.57 13.02,28.57 15.88,31.43 15.88,32.07 17.98,34.17 U1.11
N$12
  Top 0.305: LED1.A R4.1
N$13
  Top 0.305: LED2.A R5.1
N$14  (via drill 0.6)
  Top 0.61: v59.05,54.61 R12.1
  Bottom 0.61: U$1.5 v59.05,54.61
N$15
  Top 0.406: 44.77,62.83 R7.2 LED4.C
N$16
  Top 0.406: R7.1 R8.2 40.01,60.96 38.73,59.69 IC2.1
N$17
  Top 0.305: U1.13 19.58,34.5 17.46,32.38 SJ1.1
N$18
  Top 0.305: R16.2 20.95,53.44 20.95,49.21 18.78,47.04 U1.29
N$19
  Top 0.305: R11.2 17.14,52.8 17.14,50.8 17.98,49.97 U1.30
N$20  (via drill 0.6)
  Top 0.406: v45.4,40.96 R17.2
  Bottom 0.406: v45.4,40.96 45.4,46.04 42.55,48.9 18.41,48.9 17.78,49.53 17.78,55.24 15.48,57.54 JP3.3
N$21
  Top 0.406: IC2.5 38.73,53.02 39.69,52.07 R10.1
N$22  (via drill 0.6)
  Top 0.406: v42.86,40.96 R14.2
  Bottom 0.406: JP3.1 13.58,52.46 18.1,47.94 40.64,47.94 42.86,45.72 v42.86,40.96
N$23  (via drill 0.6)
  Top 0.61: v64.77,54.61 64.77,55.88 63.81,56.84 C10.1
  Bottom 0.61: U$1.2 62.87,46.99 61.59,48.26 61.59,53.34 62.87,54.61 v64.77,54.61
N$24
  Top 0.406: 20.81,59.2 20.78,59.23 | F1.1 21.94,58.07 21.11,58.9 20.81,59.2 | 20.81,59.2 CN3.VBUS
N$25
  Bottom 0.61: D1.A 52.74,41.27 L1.2 52.03,46.99 U$1.7
N$26
  Top 0.406: R8.1 LED5.A
N$27
  Top 0.254: 26.77,24.23 IC1.34
  Top 0.305: 26.77,24.23 25.4,22.86 19.05,22.86 16.51,20.32 R13.2
N$28
  Top 0.305: Q2.1 12.65,21.33 R13.1 C12.2
N$29
  Top 0.254: 26.31,24.73 IC1.33
  Top 0.305: Q2.3 8.38,26.47 9.21,27.3 11.75,27.3 | 11.75,27.3 C11.2 | 26.31,24.73 25.08,23.5 20.95,23.5 17.14,27.3 11.75,27.3
N$31
  Top 0.254: IC1.98 48.18,27.23
  Top 0.305: 48.18,27.23 48.58,27.62 C20.1
N$32  (via drill 0.6)
  Top 0.254: IC1.88 65.09,22.23
  Top 0.305: 65.09,22.23 71.75,15.56 76.52,15.56 84.14,7.94 86.04,7.94 v88.58,5.4
  Bottom 0.305: v88.58,5.4 JP5.2
N$33  (via drill 0.6)
  Top 0.254: IC1.87 64,21.73
  Top 0.305: 64,21.73 71.44,14.29 76.52,14.29 83.82,6.99 84.45,6.99 v86.04,5.4
  Bottom 0.305: v86.04,5.4 JP5.3
N$34  (via drill 0.6)
  Top 0.254: IC1.86 62.91,21.23
  Top 0.305: 62.91,21.23 71.12,13.02 76.2,13.02 83.5,5.71 v83.5,5.4
  Bottom 0.305: v83.5,5.4 JP5.4
N$35  (via drill 0.6)
  Top 0.254: IC1.85 61.83,20.73
  Top 0.305: 61.83,20.73 70.8,11.75 74.61,11.75 v80.96,5.4
  Bottom 0.305: v80.96,5.4 JP5.5
N$36  (via drill 0.6)
  Top 0.254: IC1.84 60.74,20.23
  Top 0.305: 60.74,20.23 70.48,10.48 73.34,10.48 v78.42,5.4
  Bottom 0.305: v78.42,5.4 JP5.6
N$37  (via drill 0.6)
  Top 0.254: IC1.83 59.65,19.73
  Top 0.305: 59.65,19.73 70.17,9.21 72.07,9.21 v75.88,5.4
  Bottom 0.305: v75.88,5.4 JP5.7
N$40
  Bottom 0.61: SERVOS.4 SERVOS.3 83.5,31.75 82.87,31.11 SJ2.2
PE0  (via drill 0.6)
  Top 0.254: 42.01,31.85 IC1.2
  Top 0.305: R1.2 12.7,33.12 v12.7,31.43 | v44.77,29.84 44.77,32.07 44.13,32.7 42.86,32.7 42.01,31.85
  Bottom 0.305: v12.7,31.43 12.7,30.48 13.34,29.84 24.45,29.84 27.94,26.35 41.27,26.35 v44.77,29.84
PE1  (via drill 0.6)
  Top 0.254: 41.51,32.3 IC1.3
  Top 0.305: v47.31,30.8 47.31,32.7 46.67,33.34 42.55,33.34 41.51,32.3 | R2.2 9.97,30.98 v10.16,30.8
  Bottom 0.305: v10.16,30.8 12.06,28.89 24.45,28.89 27.62,25.72 42.23,25.72 v47.31,30.8
PE4
  Top 0.254: C21.1 R17.1 45.4,34.29 45.09,33.97 41.59,33.97 40.01,32.39 IC1.6
PE5
  Top 0.254: C22.1 40.32,33.66 39.51,32.84 IC1.7
  Top 0.406: C22.1 R14.1
RESET  (via drill 0.6)
  Top 0.254: 22.04,26.23 IC1.30
  Top 0.305: 22.04,26.23 21.27,26.99 v21.27,27.3 21.27,30.48 20.95,30.8 C4.2 19.68,32.7 v20,33.02 | v26.67,5.08 28.57,6.99 28.57,14.29 26.99,15.88 v19.05,15.88
  Bottom 0.305: v20,33.02 22.23,30.8 24.45,30.8 27.94,27.3 40.32,27.3 45.09,32.07 53.34,32.07 56.83,28.57 66.67,28.57 ICSP1.5 | JP4.17 26.67,2.55 v26.67,5.08 | v19.05,15.88 20.64,17.46 20.64,19.37 21.27,20 v21.27,27.3
RESET2  (via drill 0.6)
  Top 0.305: 26.04,44.36 26.12,44.36 27.94,42.55 27.94,37.47 v28.89,36.51 | 26.04,44.36 U1.24 | 24.58,45.82 24.57,45.83 | 24.58,45.82 R9.1 | 26.04,44.36 24.58,45.82
  Bottom 0.305: ICSP2.5 30.16,37.78 v28.89,36.51
RSSI  (via drill 0.6)
  Top 0.254: IC1.97 47.57,26.73
  Top 0.305: 47.57,26.73 48.58,25.72 53.98,25.72 54.29,26.04 v54.29,28.57 | v75.56,33.02 75.56,36.2 74.61,37.15 74.61,41.27 v76.2,42.86
  Bottom 0.305: XB1.6 71.75,53.41 71.75,43.18 73.34,41.59 74.93,41.59 v76.2,42.86 | v54.29,28.57 55.56,27.3 69.85,27.3 v75.56,33.02
RX1  (via drill 0.6)
  Top 0.254: 23.8,18.73 IC1.45
  Top 0.305: v15.56,17.78 22.86,17.78 23.8,18.73
  Bottom 0.305: JP1.1 11.75,13.97 v15.56,17.78
RX2  (via drill 0.6)
  Top 0.254: v37.78,34.29 37.78,32.7 37.01,31.93 IC1.12
  Top 0.305: v22.86,27.62 22.86,29.84 v25.4,32.38
  Bottom 0.305: JP1.3 10.79,8.89 16.51,14.61 19.68,14.61 22.86,17.78 v22.86,27.62 | v25.4,32.38 29.84,27.94 37.47,27.94 37.78,28.26 v37.78,34.29
RX3  (via drill 0.6)
  Top 0.254: 36.51,11.11 IC1.63
  Top 0.305: v78.11,27.3 78.11,38.73 76.52,40.32 v76.2,40.32 | v36.2,10.79 36.51,11.11 | v4.29,4.6 12.38,12.7 v26.35,12.7
  Bottom 0.305: XB1.2 69.55,62.88 67.94,61.28 67.94,43.81 71.44,40.32 v76.2,40.32 | v78.11,27.3 60.33,9.53 37.47,9.53 v36.2,10.79 34.29,12.7 v26.35,12.7 | JP1.5 3.49,3.81 v4.29,4.6
SCK  (via drill 0.6 pad 0.25)
  Top 0.254: IC1.20 33.01,33.34 v32.38,33.97
  Top 0.305: IC4.2 75.88,51.44 72.07,47.62 72.07,43.81 70.8,42.55 69.22,42.55 62.87,36.2 58.74,36.2 v55.72,33.18
  Bottom 0.305: v32.38,33.97 33.66,35.24 53.66,35.24 v55.72,33.18 59.69,29.21 64.77,29.21 ICSP1.3
SCK2  (via drill 0.6)
  Top 0.305: v21.27,34.92 21.27,37.17 U1.15
  Bottom 0.305: v21.27,34.92 23.18,34.92 29.53,41.27 ICSP2.3
SCL  (via drill 0.6)
  Top 0.254: 24.73,19.73 IC1.43
  Top 0.305: v19.68,21.59 22.86,21.59 23.18,21.27 24.73,19.73
  Bottom 0.305: JP2.3 v19.68,21.59
SD_CS  (via drill 0.6 pad 0.41)
  Top 0.254: IC1.19 33.51,36.05
  Top 0.305: IC4.9 v86.68,46.35 88.58,46.35 90.17,44.77 R15.2 | 33.51,36.05 34.92,37.47 v35.24,37.47
  Bottom 0.305: v86.68,46.35 86.68,40.96 83.19,37.47 v35.24,37.47
SD_CSIN
  Top 0.305: U$4.2 85.09,21.58 85.09,27.3 82.87,29.53 82.87,38.42 85.09,40.64 86.68,42.23 86.68,43.81 85.41,45.09 IC4.8
SD_DATAIN  (via drill 0.6 pad 0.25)
  Top 0.305: U$4.3 84.45,20.48 84.45,26.99 82.23,29.21 82.23,40.32 v84.14,42.23 | v75.88,46.35 IC4.6
  Bottom 0.305: v75.88,46.35 80.01,42.23 v84.14,42.23
SD_SCKIN
  Top 0.305: IC4.3 80.01,50.16 80.64,49.53 80.64,42.7 79.69,41.75 79.69,18.89 80.3,18.28 U$4.5
SDA  (via drill 0.6)
  Top 0.254: 17.95,19.23 IC1.44
  Top 0.305: v17.78,19.05 17.95,19.23
  Bottom 0.305: JP2.4 v17.78,19.05
SERVO1  (via drill 0.6)
  Top 0.254: IC1.16 35.01,35.33 36.83,37.15 36.83,41.59 38.1,42.86 50.8,42.86 54.29,39.37 54.29,32.7 55.24,31.75 55.88,31.75 59.37,35.24 66.36,35.24 67.63,33.97 67.63,26.99 73.34,21.27 v76.83,21.27
  Bottom 0.254: v76.83,21.27 85.09,21.27 86.36,22.54 SERVOS.1
SERVO2  (via drill 0.6)
  Top 0.254: IC1.15 35.51,34.56 38.1,37.15 38.1,40.96 39.37,42.23 50.16,42.23 53.66,38.73 53.66,32.07 54.61,31.11 56.2,31.11 59.69,34.61 64.45,34.61 65.09,33.97 65.09,27.62 73.66,19.05 v76.83,19.05
  Bottom 0.254: v76.83,19.05 85.41,19.05 88.9,22.54 SERVOS.2
TX1  (via drill 0.6)
  Top 0.254: 24.57,18.23 IC1.46
  Top 0.305: v17.46,16.83 23.18,16.83 24.57,18.23
  Bottom 0.305: v17.46,16.83 14.61,13.97 12.7,13.97 10.16,11.43 JP1.2
TX2  (via drill 0.6)
  Top 0.254: v36.51,33.34 IC1.13
  Top 0.305: v24.45,27.3 24.45,29.84 v27.15,32.54
  Bottom 0.305: v36.51,33.34 32.7,29.53 30.16,29.53 v27.15,32.54 | JP1.4 9.84,6.35 17.14,13.65 20,13.65 23.5,17.14 23.5,26.04 24.45,26.99 v24.45,27.3
TX3  (via drill 0.6, 0.6 pad 0.25)
  Top 0.254: v38.42,11.43 37.01,12.84 IC1.64
  Top 0.305: v86.68,50.16 IC4.12 | v33.34,6.35 v38.42,11.43
  Bottom 0.305: v38.42,11.43 59.05,11.43 72.07,24.45 72.07,26.67 77.47,32.07 79.06,32.07 88.27,41.27 88.27,48.58 v86.68,50.16 | v33.34,6.35 27.62,6.35 25.72,8.26 17.46,8.26 14.29,5.08 6.51,5.08 4.6,3.17 4.6,1.75 4.13,1.27 JP1.6
VBATT  (via drill 0.6)
  Top 0.406: C17.1 87.7,63.18 U$2.8 79.13,67.94 | 47.31,58.74 47.31,62.87 52.39,67.94 53.02,67.94 | C23.+ 53.66,67.31 53.02,67.94 | 53.02,67.94 79.13,67.94 | SJ3.2 83.38,67.94 79.13,67.94
  Top 0.61: JP6.1 43.81,58.74 47.31,58.74 49.53,58.74 50.98,57.29 C7.+ 53.18,56.2 | C8.1 55.88,56.2 53.18,56.2 | v53.34,53.98 53.34,56.04 53.18,56.2
  Bottom 0.61: L1.1 49.53,49.53 53.34,49.53 | 53.34,49.53 U$1.6 | v53.34,53.98 53.34,49.53
VBATT1
  Top 0.406: JP6.2 41.27,54.61 39.69,56.2 36.67,56.2 | 36.67,56.2 35.88,56.2 35.14,55.46 C6.+ | IC2.3 36.83,56.36 36.67,56.2
  Top 0.508: IC2.3 36.83,61.98 CN2.1
VCC  (via drill 0.6)
  Top 0.254: 46.55,18.23 IC1.80 | 35.51,16.78 IC1.61 | 35.57,25.73 IC1.31 | 44.48,28.26 38.01,28.26 | 46.96,28.23 IC1.100
  Top 0.305: v60.33,33.66 57.15,30.48 51.12,30.48 50.64,30.96 | v50.8,39.37 50.8,31.11 50.64,30.96 | C19.1 49.28,15.49 46.55,18.23 | IC1.80 36.96,18.23 36.83,18.1 | 36.83,18.1 35.51,16.78 | 38.01,28.26 IC1.10 | IC1.100 44.48,28.26 | 35.57,25.73 36.83,24.46 36.83,18.1 | 46.96,28.23 49.21,30.48 50.16,30.48 50.64,30.96 | R15.1 91.44,40.01 v93.03,40.01 | v11.11,16.51 13.34,14.29 v23.5,14.29 | v70.48,26.04 72.39,27.94 72.39,29.53 | v21.59,11.43 R18.1 | R5.2 R4.2 6.03,38.1 8.54,40.6 C3.1 | R9.2 27.8,49.51 30.48,46.83 v30.48,46.04
  Top 0.406: C19.1 C14.1 C13.1 56.2,15.52 | 17.18,43.5 17.18,42.58 16.56,41.96 U1.4 13.86,41.96 12.51,40.6 C3.1 | 17.18,43.5 U1.31 | 17.18,43.5 16.38,44.3 U1.32 16.38,47.12 v15.56,47.94 | C24.+ 63.18,65.72 v64.77,64.14 | 56.2,15.52 56.2,13.02 v62.23,6.99 | 56.2,15.52 56.2,15.56
  Top 0.61: v64.77,64.14 C9.+ | v77.47,24.45 72.39,29.53 72.39,33.97 69.85,36.51 69.85,39.05 v69.53,39.37
  Bottom 0.305: ICSP1.2 63.5,33.66 v60.33,33.66 | JP2.5 v11.11,16.51 | v21.59,11.43 21.59,12.38 v23.5,14.29 33.97,24.77 42.86,24.77 44.13,26.04 v70.48,26.04
  Bottom 0.406: 37.15,39.37 ICSP2.2 v30.48,46.04 17.46,46.04 v15.56,47.94 | 64.72,4.5 v62.23,6.99
  Bottom 0.61: D1.C 64.77,41.27 66.99,43.5 66.99,52.07 | 66.99,52.07 66.99,61.91 v64.77,64.14 | 66.99,52.07 U$1.4 | D1.C 64.14,40.01 63.5,39.37 v50.8,39.37 37.15,39.37 | 80.33,27.3 v77.47,24.45 64.72,11.7 64.72,4.5 JP4.2 | v93.03,40.01 88.9,40.01 80.33,31.43 80.33,27.3 | v69.53,39.37 66.04,39.37 D1.C | SJ2.1 81.47,28.45 80.33,27.3